# EAGLE schematic simpler dj midi controlle (EAGLE 9.2.2)
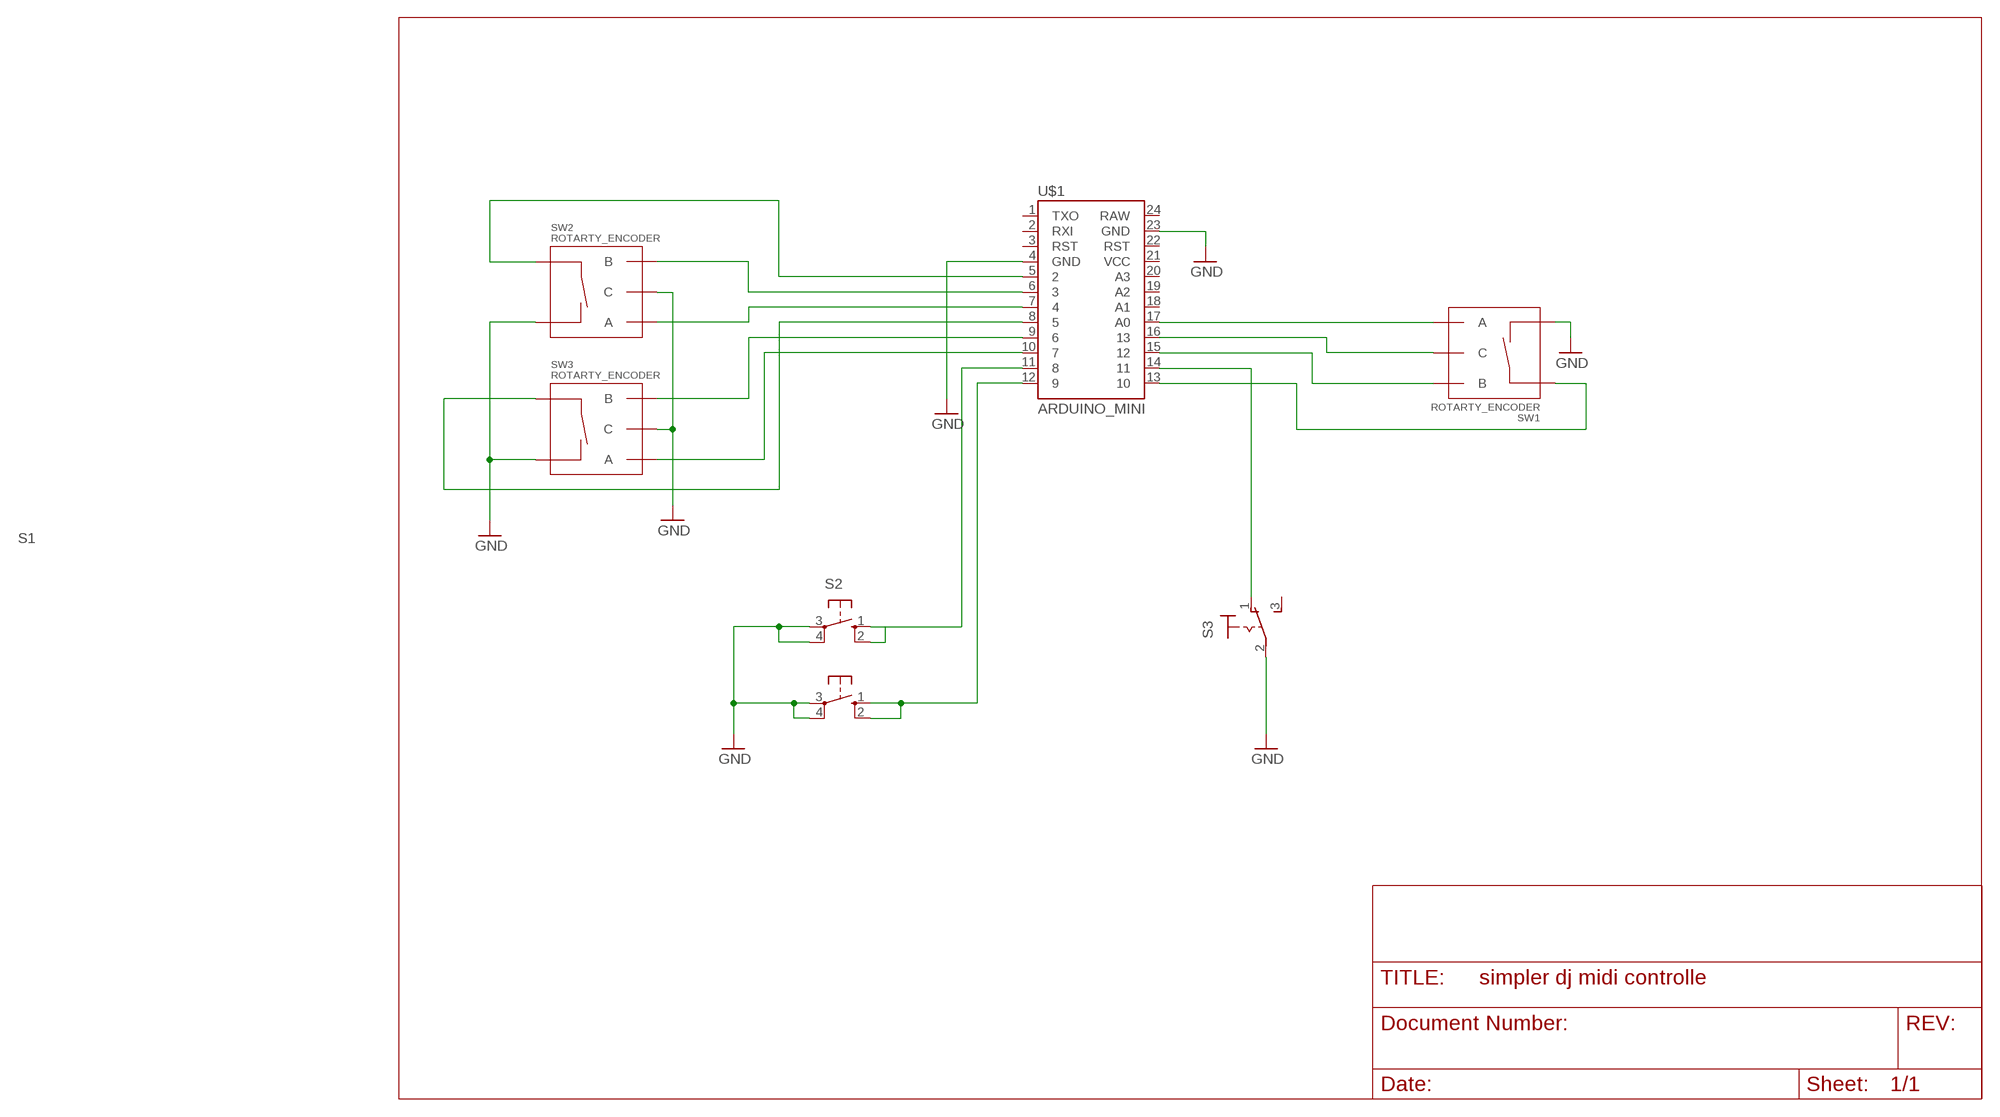
[diagram p0: schematic, sheet 1]

## Parts
S1  10-XX  [B3F-10XX]
S2  10-XX  [B3F-10XX]
S3  320-916  [320-916]
SW1  ROTARTY_ENCODER  [ROTARY_ENC_PLAIN]
SW2  ROTARTY_ENCODER  [ROTARY_ENC_PLAIN]
SW3  ROTARTY_ENCODER  [ROTARY_ENC_PLAIN]
U$1  ARDUINO_MINI  [ARDUINO_MINI]

## Nets
GND: S1.3(P) S1.4(P1) S2.3(P) S2.4(P1) S3.2(P) SW1.SW- SW2.C SW2.SW- SW3.C SW3.SW- U$1.4(GND) U$1.23(GND)
N$1: SW1.A U$1.17(A0)
N$2: SW1.SW+ U$1.13
N$3: SW2.B U$1.6
N$4: SW1.C U$1.16
N$5: SW1.B U$1.15
N$6: SW2.A U$1.7
N$7: SW3.B U$1.9
N$8: SW3.A U$1.10
N$9: S1.1(S) S1.2(S1) U$1.12
N$10: S3.1(O) U$1.14
N$11: SW3.SW+ U$1.8
N$12: S2.1(S) S2.2(S1) U$1.11
N$14: SW2.SW+ U$1.5
Unconnected: S3.3(S) U$1.1(TXO) U$1.2(RXI) U$1.3(RST) U$1.18(A1) U$1.19(A2) U$1.20(A3) U$1.21(VCC) U$1.22(RST) U$1.24(RAW)

## Library data of the parts
S1 S2 = switch-omron:10-XX: OMRON SWITCH; MPN: B3F-1000; OC_FARNELL: 176432; OC_NEWARK: 36M3542
S3 = switch:320-916: TOGGLE SWITCH distributor RS Components
SW1-SW3 = SparkFun-Electromechanical:ROTARTY_ENCODER: Simple no LED rotary encoder Example: COM-09117
U$1 = SparkFun-Boards:ARDUINO_MINI: Arduino Pro Mini footprint